# Altium schematic sheet VI_monitor.SchDoc
size 279 x 215 mm
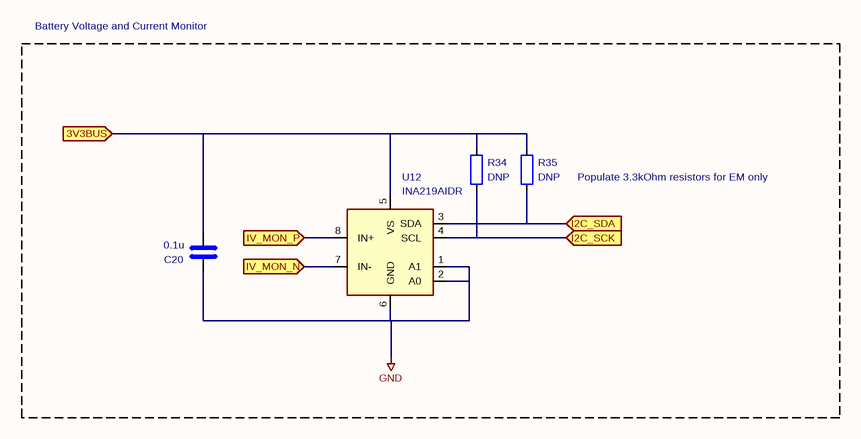
[diagram p0: VI_monitor.SchDoc]

## Parts
C20  0.1u  [C_0402_1005Metric]
R34  DNP  [R_0603_1608Metric]
R35  DNP  [R_0603_1608Metric]
U12  INA219AIDR  [SOIC-8_3.9x4.9mm_P1.27mm]

## Ports
3V3BUS (in), I2C_SCK (in), I2C_SDA (in), IV_MON_N (in), IV_MON_P (in)

## Nets
GND: C20.1 U12.1(A1) U12.2(A0) U12.6(GND)
3V3BUS: C20.2 R34.2 R35.2 U12.5(VS) ; port 3V3BUS
I2C_SCK: R34.1 U12.4(SCL) ; port I2C_SCK
I2C_SDA: R35.1 U12.3(SDA) ; port I2C_SDA
IV_MON_N: U12.7(IN-) ; port IV_MON_N
IV_MON_P: U12.8(IN+) ; port IV_MON_P

## Notes on the sheet
- Battery Voltage and Current Monitor
- (near R35) Populate 3.3kOhm resistors for EM only
- 1
- 2
- 3
- 4
- 5
- A
- B
- C
- D
- Title:
- File: VI_monitor.kicad_sch
- Sheet: /
- KiCad E.D.A.  kicad (5.1.4)-1
- Size: USLetter
- Date:
- Rev:
- Id: 1/1

## Library data of the parts
C20 = C: Value: 0.1u; Footprint: Capacitor_SMD:C_0402_1005Metric
R34 R35 = R: Value: DNP; Footprint: Resistor_SMD:R_0603_1608Metric
U12 = INA219AxD: Value: INA219AIDR; Footprint: Package_SO:SOIC-8_3.9x4.9mm_P1.27mm